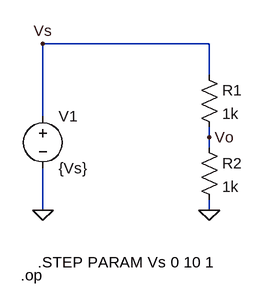
[diagram p0: schematic Circuit_03.asc]
Circuit_03.asc, the LTspice schematic file:
Version 4
SHEET 1 880 680
WIRE 224 48 -32 48
WIRE 224 96 224 48
WIRE -32 160 -32 48
WIRE 224 192 224 176
WIRE 224 208 224 192
WIRE -32 304 -32 240
WIRE 224 304 224 288
FLAG 224 304 0
FLAG -32 304 0
FLAG -32 48 Vs
FLAG 224 192 Vo
SYMBOL res 208 80 R0
SYMATTR InstName R1
SYMATTR Value 1k
SYMBOL voltage -32 144 R0
WINDOW 123 0 0 Left 0
WINDOW 39 0 0 Left 0
SYMATTR InstName V1
SYMATTR Value {Vs}
SYMBOL res 208 192 R0
SYMATTR InstName R2
SYMATTR Value 1k
TEXT -40 384 Left 2 !.STEP PARAM Vs 0 10 1
TEXT -66 404 Left 2 !.op

The netlist it stands for:
* Circuit_03.asc
R1 Vs Vo 1k
V1 Vs 0 {Vs}
R2 Vo 0 1k
.STEP PARAM Vs 0 10 1
.op
.backanno
.end